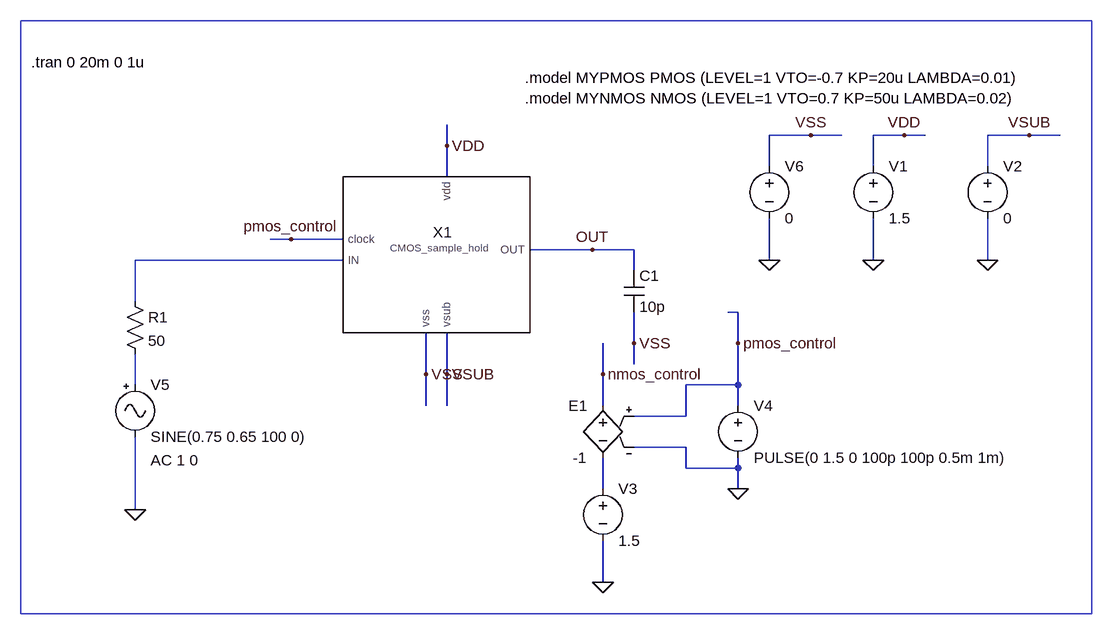
[diagram p0: schematic dsproj_sampleandhold_tb.asc]
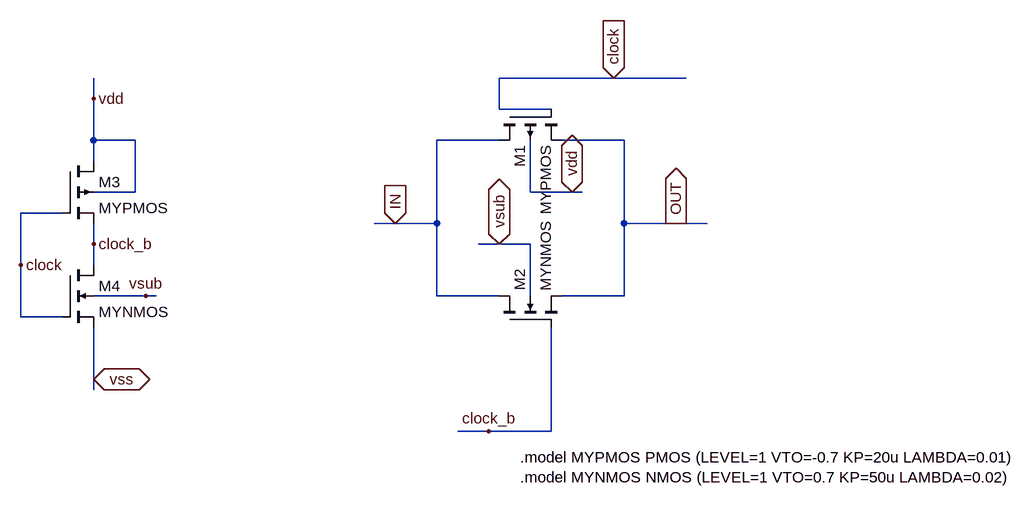
[diagram p1: sub-circuit dsproj_cmossampleandhold.asc]
dsproj_sampleandhold_tb.asc, the LTspice schematic file:
Version 4.1
SHEET 1 880 680
WIRE 112 -208 48 -208
WIRE 160 -208 112 -208
WIRE 256 -208 208 -208
WIRE 288 -208 256 -208
WIRE 448 -208 384 -208
WIRE 496 -208 448 -208
WIRE -448 -192 -448 -224
WIRE 48 -160 48 -208
WIRE 208 -160 208 -208
WIRE 384 -160 384 -208
WIRE -448 -144 -448 -192
WIRE -688 -48 -720 -48
WIRE -608 -48 -688 -48
WIRE -224 -32 -320 -32
WIRE -160 -32 -224 -32
WIRE -608 -16 -928 -16
WIRE 48 -16 48 -80
WIRE 208 -16 208 -80
WIRE 384 -16 384 -80
WIRE -160 0 -160 -32
WIRE -928 48 -928 -16
WIRE 0 64 -16 64
WIRE -160 112 -160 64
WIRE 0 112 0 64
WIRE -160 144 -160 112
WIRE -480 160 -480 96
WIRE -448 160 -448 96
WIRE -208 160 -208 112
WIRE -928 176 -928 128
WIRE 0 176 0 112
WIRE 0 176 -80 176
WIRE -480 208 -480 160
WIRE -448 208 -448 160
WIRE -208 208 -208 160
WIRE 0 208 0 176
WIRE -80 224 -80 176
WIRE -80 224 -160 224
WIRE -80 272 -160 272
WIRE -80 304 -80 272
WIRE 0 304 0 288
WIRE 0 304 -80 304
WIRE -208 336 -208 288
WIRE 0 336 0 304
WIRE -928 368 -928 256
WIRE -208 480 -208 416
WIRE -192 480 -208 480
FLAG 208 -16 0
FLAG 384 -16 0
FLAG 256 -208 VDD
FLAG 448 -208 VSUB
FLAG -208 480 0
FLAG 0 336 0
FLAG -928 368 0
FLAG -448 -192 VDD
FLAG -208 160 nmos_control
FLAG 0 112 pmos_control
FLAG -224 -32 OUT
FLAG -448 160 VSUB
FLAG 48 -16 0
FLAG 112 -208 VSS
FLAG -160 112 VSS
FLAG -688 -48 pmos_control
FLAG -480 160 VSS
SYMBOL dsproj_cmossampleandhold -464 0 R0
SYMATTR InstName X1
SYMBOL voltage 208 -176 R0
WINDOW 123 0 0 Left 0
WINDOW 39 0 0 Left 0
SYMATTR InstName V1
SYMATTR Value 1.5
SYMBOL voltage 384 -176 R0
WINDOW 123 0 0 Left 0
WINDOW 39 0 0 Left 0
SYMATTR InstName V2
SYMATTR Value 0
SYMBOL voltage -208 320 R0
WINDOW 123 0 0 Left 0
WINDOW 39 0 0 Left 0
SYMATTR InstName V3
SYMATTR Value 1.5
SYMBOL voltage 0 192 R0
WINDOW 123 0 0 Left 0
WINDOW 39 0 0 Left 0
SYMATTR InstName V4
SYMATTR Value PULSE(0 1.5 0 100p 100p 0.5m 1m)
SYMBOL e -208 192 M0
SYMATTR InstName E1
SYMATTR Value -1
SYMBOL Misc\\signal -928 160 R0
WINDOW 123 24 132 Left 2
WINDOW 39 0 0 Left 0
SYMATTR Value2 AC 1 0
SYMATTR InstName V5
SYMATTR Value SINE(0.75 0.65 100 0)
SYMBOL res -944 32 R0
SYMATTR InstName R1
SYMATTR Value 50
SYMBOL cap -176 0 R0
SYMATTR InstName C1
SYMATTR Value 10p
SYMBOL voltage 48 -176 R0
WINDOW 123 0 0 Left 0
WINDOW 39 0 0 Left 0
SYMATTR InstName V6
SYMATTR Value 0
TEXT -1088 -320 Left 2 !.tran 0 20m 0 1u
TEXT -328 -296 Left 2 !.model MYPMOS PMOS (LEVEL=1 VTO=-0.7 KP=20u LAMBDA=0.01)\n.model MYNMOS NMOS (LEVEL=1 VTO=0.7 KP=50u LAMBDA=0.02)
RECTANGLE Normal 544 528 -1104 -384

dsproj_cmossampleandhold.asc, the sub-circuit schematic file:
Version 4.1
SHEET 1 1400 756
WIRE 128 -208 -48 -208
WIRE 240 -208 128 -208
WIRE -672 -176 -672 -208
WIRE -48 -160 -48 -208
WIRE 32 -160 -48 -160
WIRE -672 -112 -672 -176
WIRE -608 -112 -672 -112
WIRE -48 -112 -144 -112
WIRE 144 -112 48 -112
WIRE -672 -80 -672 -112
WIRE -608 -32 -608 -112
WIRE -608 -32 -672 -32
WIRE 0 -32 0 -112
WIRE 64 -32 0 -32
WIRE 80 -32 64 -32
WIRE -720 0 -784 0
WIRE -208 16 -240 16
WIRE -144 16 -144 -112
WIRE -144 16 -208 16
WIRE 144 16 144 -112
WIRE 224 16 144 16
WIRE 272 16 224 16
WIRE -672 48 -672 16
WIRE -48 48 -80 48
WIRE 0 48 -48 48
WIRE -784 80 -784 0
WIRE -672 80 -672 48
WIRE -592 128 -672 128
WIRE -576 128 -592 128
WIRE -144 128 -144 16
WIRE -48 128 -144 128
WIRE 0 128 0 48
WIRE 144 128 144 16
WIRE 144 128 48 128
WIRE -784 160 -784 80
WIRE -720 160 -784 160
WIRE -672 256 -672 176
WIRE -672 272 -672 256
WIRE -64 336 -112 336
WIRE 32 336 32 176
WIRE 32 336 -64 336
FLAG 128 -208 clock
IOPIN 128 -208 In
FLAG 64 -32 vdd
IOPIN 64 -32 BiDir
FLAG -48 48 vsub
IOPIN -48 48 BiDir
FLAG -208 16 IN
IOPIN -208 16 In
FLAG 224 16 OUT
IOPIN 224 16 Out
FLAG -592 128 vsub
FLAG -672 -176 vdd
FLAG -784 80 clock
FLAG -672 48 clock_b
FLAG -64 336 clock_b
FLAG -672 256 vss
IOPIN -672 256 BiDir
SYMBOL pmos4 -48 -160 M90
SYMATTR InstName M1
SYMATTR Value MYPMOS
SYMATTR Value2 l=180e-9 w=2400e-9
SYMBOL nmos4 -48 176 R270
SYMATTR InstName M2
SYMATTR Value MYNMOS
SYMATTR Value2 l=180e-9 w=1200e-9
SYMBOL pmos4 -720 -80 R0
SYMATTR InstName M3
SYMATTR Value MYPMOS
SYMATTR Value2 l=180e-9 w=2.4e-6 m=1
SYMBOL nmos4 -720 80 R0
SYMATTR InstName M4
SYMATTR Value MYNMOS
SYMATTR Value2 l=180e-9 w=1.2e-6 m=1
TEXT -16 376 Left 2 !.model MYPMOS PMOS (LEVEL=1 VTO=-0.7 KP=20u LAMBDA=0.01)\n.model MYNMOS NMOS (LEVEL=1 VTO=0.7 KP=50u LAMBDA=0.02)

The netlist it stands for:
* dsproj_sampleandhold_tb.asc
X§X1 N001 pmos_control OUT VDD VSUB VSS dsproj_cmossampleandhold
V1 VDD 0 1.5
V2 VSUB 0 0
V3 N003 0 1.5
V4 pmos_control 0 PULSE(0 1.5 0 100p 100p 0.5m 1m)
E1 nmos_control N003 pmos_control 0 -1
V5 N002 0 SINE(0.75 0.65 100 0) AC 1 0
R1 N001 N002 50
C1 OUT VSS 10p
V6 VSS 0 0

* block symbol definitions
.subckt dsproj_cmossampleandhold IN clock OUT vdd vsub vss
M1 IN clock OUT vdd MYPMOS l=180e-9 w=2400e-9
M2 IN clock_b OUT vsub MYNMOS l=180e-9 w=1200e-9
M3 vdd clock clock_b vdd MYPMOS l=180e-9 w=2.4e-6 m=1
M4 clock_b clock vss vsub MYNMOS l=180e-9 w=1.2e-6 m=1
.model MYPMOS PMOS (LEVEL=1 VTO=-0.7 KP=20u LAMBDA=0.01)
.model MYNMOS NMOS (LEVEL=1 VTO=0.7 KP=50u LAMBDA=0.02)
.ends dsproj_cmossampleandhold

.model NMOS NMOS
.model PMOS PMOS
.lib standard.mos
.tran 0 20m 0 1u
.model MYPMOS PMOS (LEVEL=1 VTO=-0.7 KP=20u LAMBDA=0.01)
.model MYNMOS NMOS (LEVEL=1 VTO=0.7 KP=50u LAMBDA=0.02)
.backanno
.end